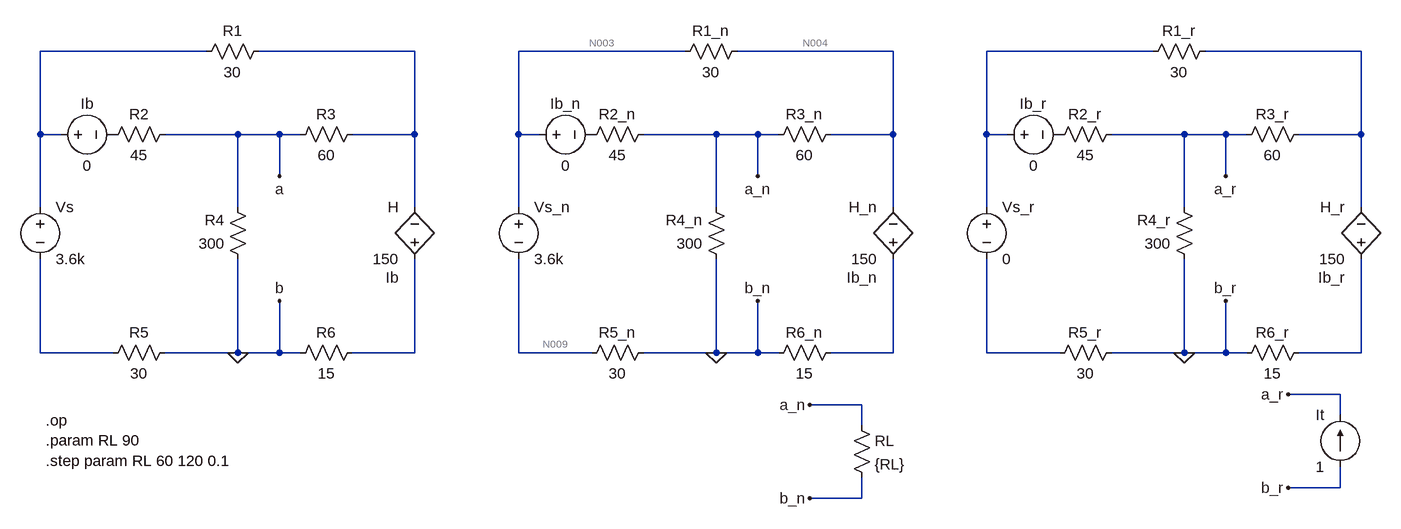
[diagram p0: schematic HW04P03.asc]
HW04P03.asc, the LTspice schematic file:
Version 4
SHEET 1 2148 680
WIRE 336 -112 80 -112
WIRE 656 -112 416 -112
WIRE 1072 -112 816 -112
WIRE 1392 -112 1152 -112
WIRE 1792 -112 1536 -112
WIRE 2112 -112 1872 -112
WIRE 80 16 80 -112
WIRE 112 16 80 16
WIRE 384 16 272 16
WIRE 448 16 384 16
WIRE 480 16 448 16
WIRE 656 16 656 -112
WIRE 656 16 560 16
WIRE 816 16 816 -112
WIRE 848 16 816 16
WIRE 1120 16 1008 16
WIRE 1184 16 1120 16
WIRE 1216 16 1184 16
WIRE 1392 16 1392 -112
WIRE 1392 16 1296 16
WIRE 1536 16 1536 -112
WIRE 1568 16 1536 16
WIRE 1840 16 1728 16
WIRE 1904 16 1840 16
WIRE 1936 16 1904 16
WIRE 2112 16 2112 -112
WIRE 2112 16 2016 16
WIRE 448 80 448 16
WIRE 1184 80 1184 16
WIRE 1904 80 1904 16
WIRE 80 128 80 16
WIRE 384 128 384 16
WIRE 656 128 656 16
WIRE 816 128 816 16
WIRE 1120 128 1120 16
WIRE 1392 128 1392 16
WIRE 1536 128 1536 16
WIRE 1840 128 1840 16
WIRE 2112 128 2112 16
WIRE 80 352 80 208
WIRE 192 352 80 352
WIRE 384 352 384 208
WIRE 384 352 272 352
WIRE 448 352 448 272
WIRE 448 352 384 352
WIRE 480 352 448 352
WIRE 656 352 656 208
WIRE 656 352 560 352
WIRE 816 352 816 208
WIRE 928 352 816 352
WIRE 1120 352 1120 208
WIRE 1120 352 1008 352
WIRE 1184 352 1184 272
WIRE 1184 352 1120 352
WIRE 1216 352 1184 352
WIRE 1392 352 1392 208
WIRE 1392 352 1296 352
WIRE 1536 352 1536 208
WIRE 1648 352 1536 352
WIRE 1840 352 1840 208
WIRE 1840 352 1728 352
WIRE 1904 352 1904 272
WIRE 1904 352 1840 352
WIRE 1936 352 1904 352
WIRE 2112 352 2112 208
WIRE 2112 352 2016 352
WIRE 2080 416 2000 416
WIRE 1344 432 1264 432
WIRE 2080 448 2080 416
WIRE 1344 464 1344 432
WIRE 2080 560 2080 528
WIRE 2080 560 2000 560
WIRE 1344 576 1344 544
WIRE 1344 576 1264 576
FLAG 384 352 0
FLAG 448 80 a
FLAG 448 272 b
FLAG 1120 352 0
FLAG 1184 80 a_n
FLAG 1184 272 b_n
FLAG 1840 352 0
FLAG 1904 80 a_r
FLAG 1904 272 b_r
FLAG 2000 416 a_r
FLAG 2000 560 b_r
FLAG 1264 432 a_n
FLAG 1264 576 b_n
DATAFLAG 448 64 ""
DATAFLAG 1184 64 ""
DATAFLAG 1904 64 ""
SYMBOL voltage 80 112 R0
SYMATTR InstName Vs
SYMATTR Value 3.6k
SYMBOL res 288 0 R90
WINDOW 0 0 56 VBottom 2
WINDOW 3 32 56 VTop 2
SYMATTR InstName R2
SYMATTR Value 45
SYMBOL res 288 336 R90
WINDOW 0 0 56 VBottom 2
WINDOW 3 32 56 VTop 2
SYMATTR InstName R5
SYMATTR Value 30
SYMBOL res 400 224 R180
WINDOW 0 36 76 Left 2
WINDOW 3 36 40 Left 2
SYMATTR InstName R4
SYMATTR Value 300
SYMBOL res 320 -96 R270
WINDOW 0 32 56 VTop 2
WINDOW 3 0 56 VBottom 2
SYMATTR InstName R1
SYMATTR Value 30
SYMBOL res 464 32 R270
WINDOW 0 32 56 VTop 2
WINDOW 3 0 56 VBottom 2
SYMATTR InstName R3
SYMATTR Value 60
SYMBOL res 464 368 R270
WINDOW 0 32 56 VTop 2
WINDOW 3 0 56 VBottom 2
SYMATTR InstName R6
SYMATTR Value 15
SYMBOL h 656 224 R180
WINDOW 0 24 96 Left 2
WINDOW 3 24 16 Left 2
WINDOW 38 24 -12 Left 2
SYMATTR InstName H
SYMATTR Value 150
SYMATTR SpiceModel Ib
SYMBOL voltage 96 16 R270
WINDOW 0 32 56 VTop 2
WINDOW 3 -32 56 VBottom 2
SYMATTR InstName Ib
SYMATTR Value 0
SYMBOL voltage 816 112 R0
SYMATTR InstName Vs_n
SYMATTR Value 3.6k
SYMBOL res 1024 0 R90
WINDOW 0 0 56 VBottom 2
WINDOW 3 32 56 VTop 2
SYMATTR InstName R2_n
SYMATTR Value 45
SYMBOL res 1024 336 R90
WINDOW 0 0 56 VBottom 2
WINDOW 3 32 56 VTop 2
SYMATTR InstName R5_n
SYMATTR Value 30
SYMBOL res 1136 224 R180
WINDOW 0 36 76 Left 2
WINDOW 3 36 40 Left 2
SYMATTR InstName R4_n
SYMATTR Value 300
SYMBOL res 1056 -96 R270
WINDOW 0 32 56 VTop 2
WINDOW 3 0 56 VBottom 2
SYMATTR InstName R1_n
SYMATTR Value 30
SYMBOL res 1200 32 R270
WINDOW 0 32 56 VTop 2
WINDOW 3 0 56 VBottom 2
SYMATTR InstName R3_n
SYMATTR Value 60
SYMBOL res 1200 368 R270
WINDOW 0 32 56 VTop 2
WINDOW 3 0 56 VBottom 2
SYMATTR InstName R6_n
SYMATTR Value 15
SYMBOL h 1392 224 R180
WINDOW 0 24 96 Left 2
WINDOW 3 24 16 Left 2
WINDOW 38 24 -12 Left 2
SYMATTR InstName H_n
SYMATTR Value 150
SYMATTR SpiceModel Ib_n
SYMBOL voltage 832 16 R270
WINDOW 0 32 56 VTop 2
WINDOW 3 -32 56 VBottom 2
SYMATTR InstName Ib_n
SYMATTR Value 0
SYMBOL voltage 1536 112 R0
SYMATTR InstName Vs_r
SYMATTR Value 0
SYMBOL res 1744 0 R90
WINDOW 0 0 56 VBottom 2
WINDOW 3 32 56 VTop 2
SYMATTR InstName R2_r
SYMATTR Value 45
SYMBOL res 1744 336 R90
WINDOW 0 0 56 VBottom 2
WINDOW 3 32 56 VTop 2
SYMATTR InstName R5_r
SYMATTR Value 30
SYMBOL res 1856 224 R180
WINDOW 0 36 76 Left 2
WINDOW 3 36 40 Left 2
SYMATTR InstName R4_r
SYMATTR Value 300
SYMBOL res 1776 -96 R270
WINDOW 0 32 56 VTop 2
WINDOW 3 0 56 VBottom 2
SYMATTR InstName R1_r
SYMATTR Value 30
SYMBOL res 1920 32 R270
WINDOW 0 32 56 VTop 2
WINDOW 3 0 56 VBottom 2
SYMATTR InstName R3_r
SYMATTR Value 60
SYMBOL res 1920 368 R270
WINDOW 0 32 56 VTop 2
WINDOW 3 0 56 VBottom 2
SYMATTR InstName R6_r
SYMATTR Value 15
SYMBOL h 2112 224 R180
WINDOW 0 24 96 Left 2
WINDOW 3 24 16 Left 2
WINDOW 38 24 -12 Left 2
SYMATTR InstName H_r
SYMATTR Value 150
SYMATTR SpiceModel Ib_r
SYMBOL voltage 1552 16 R270
WINDOW 0 32 56 VTop 2
WINDOW 3 -32 56 VBottom 2
SYMATTR InstName Ib_r
SYMATTR Value 0
SYMBOL current 2080 528 R180
WINDOW 0 24 80 Left 2
WINDOW 3 24 0 Left 2
SYMATTR InstName It
SYMATTR Value 1
SYMBOL res 1328 448 R0
SYMATTR InstName RL
SYMATTR Value {RL}
TEXT 88 456 Left 2 !.op\n.param RL 90\n.step param RL 60 120 0.1

The netlist it stands for:
* HW04P03.asc
Vs N001 N007 3.6k
R2 a P001 45
R5 0 N007 30
R4 0 a 300
R1 N001 N002 30
R3 a N002 60
R6 0 N008 15
H N008 N002 Ib 150
V§Ib N001 P001 0
Vs_n N003 N009 3.6k
R2_n a_n P002 45
R5_n 0 N009 30
R4_n 0 a_n 300
R1_n N003 N004 30
R3_n a_n N004 60
R6_n 0 N010 15
H_n N010 N004 Ib_n 150
V§Ib_n N003 P002 0
Vs_r N005 N011 0
R2_r a_r P003 45
R5_r 0 N011 30
R4_r 0 a_r 300
R1_r N005 N006 30
R3_r a_r N006 60
R6_r 0 N012 15
H_r N012 N006 Ib_r 150
V§Ib_r N005 P003 0
It 0 a_r 1
RL a_n 0 {RL}
.op
.param RL 90
.step param RL 60 120 0.1
.backanno
.end

* Results of the author's LTspice run, read from the files saved beside the schematic
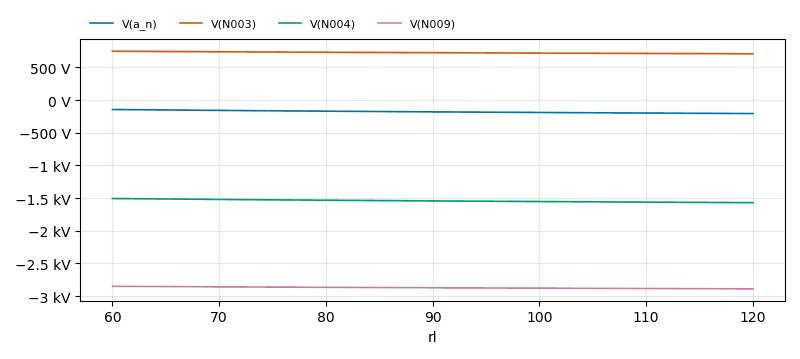
[diagram p1: Operating Point of HW04P03.asc, plotted from the saved traces]
* Operating Point, 1 run:
*   V(a_n): -144 V at rl=60 , -205.7 V at rl=120 , min -205.7 V, max -144 V
*   V(N003): 748.8 V at rl=60 , 709.7 V at rl=120 , min 709.7 V, max 748.8 V
*   V(N004): -1.507 kV at rl=60 , -1.57 kV at rl=120 , min -1.57 kV, max -1.507 kV
*   V(N009): -2.851 kV at rl=60 , -2.89 kV at rl=120 , min -2.89 kV, max -2.851 kV